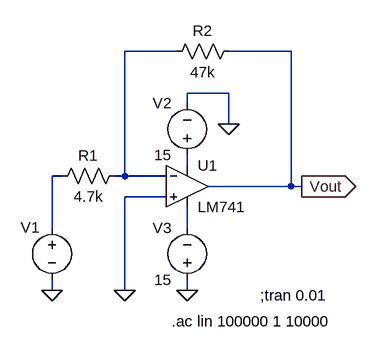
[diagram p0: schematic lab5_3.asc]
lab5_3.asc, the LTspice schematic file:
Version 4
SHEET 1 880 680
WIRE 160 -32 80 -32
WIRE 336 -32 240 -32
WIRE 240 32 176 32
WIRE 176 48 176 32
WIRE 240 80 240 32
WIRE 176 144 176 128
WIRE -16 160 -32 160
WIRE 80 160 80 -32
WIRE 80 160 64 160
WIRE 144 160 80 160
WIRE 336 176 336 -32
WIRE 336 176 208 176
WIRE 352 176 336 176
WIRE 144 192 80 192
WIRE -32 240 -32 160
WIRE 176 240 176 208
WIRE -32 336 -32 320
WIRE 80 336 80 192
WIRE 176 336 176 320
FLAG -32 336 0
FLAG 240 80 0
FLAG 176 336 0
FLAG 352 176 Vout
IOPIN 352 176 Out
FLAG 80 336 0
SYMBOL OpAmps\\LM741 176 112 R0
SYMATTR InstName U1
SYMBOL voltage -32 224 R0
WINDOW 3 24 96 Invisible 2
WINDOW 39 0 0 Left 0
WINDOW 0 -48 15 Left 2
SYMATTR Value SINE(0 1 200 1e-6 0 0)
SYMATTR Value2 AC 1
SYMATTR InstName V1
SYMBOL voltage 176 144 R180
WINDOW 0 24 96 Left 2
WINDOW 3 24 16 Left 2
WINDOW 123 0 0 Left 0
WINDOW 39 0 0 Left 0
SYMATTR InstName V2
SYMATTR Value 15
SYMBOL voltage 176 336 R180
WINDOW 0 24 96 Left 2
WINDOW 3 24 16 Left 2
WINDOW 123 0 0 Left 0
WINDOW 39 0 0 Left 0
SYMATTR InstName V3
SYMATTR Value 15
SYMBOL res 80 144 R90
WINDOW 0 0 56 VBottom 2
WINDOW 3 32 56 VTop 2
SYMATTR InstName R1
SYMATTR Value 4.7k
SYMBOL res 256 -48 R90
WINDOW 0 0 56 VBottom 2
WINDOW 3 32 56 VTop 2
SYMATTR InstName R2
SYMATTR Value 47k
TEXT 288 344 Left 2 !;tran 0.01
TEXT 152 384 Left 2 !.ac lin 100000 1 10000

The netlist it stands for:
* lab5_3.asc
XU1 0 N001 N002 N004 Vout LM741  ; pins In+ In- V+ V- OUT
V1 N003 0 SINE(0 1 200 1e-6 0 0) AC 1
V2 N002 0 15
V3 0 N004 15
R1 N001 N003 4.7k
R2 Vout N001 47k
;tran 0.01
.ac lin 100000 1 10000
.lib LM741.lib
.backanno
.end